# EAGLE design DSP (EAGLE 9.4.2)
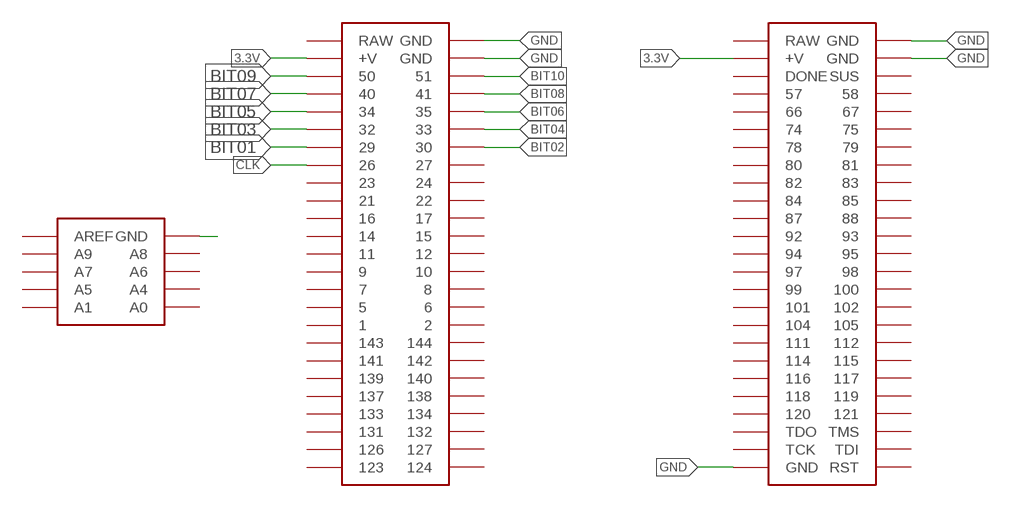
[diagram p0: schematic, sheet 1, part 1 of 2]
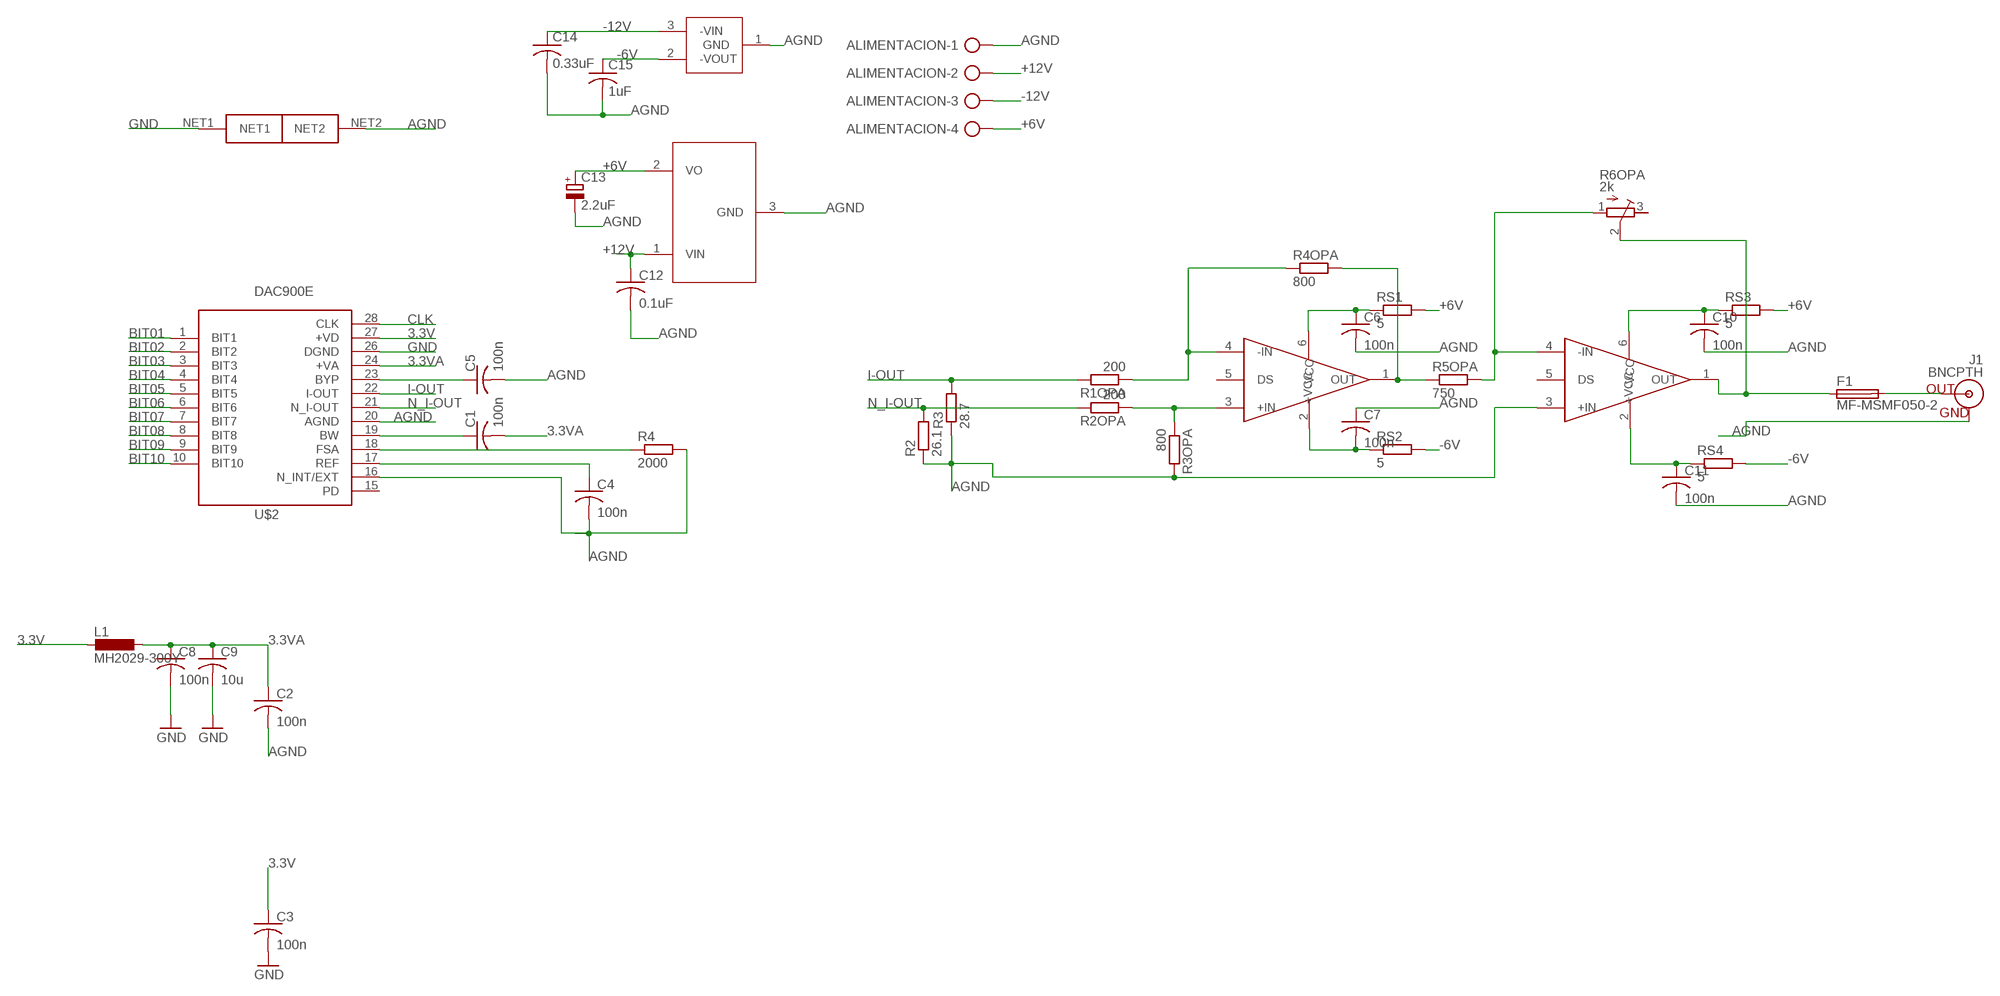
[diagram p1: schematic, sheet 1, part 2 of 2]

## Parts
ALIMENTACION  AK300/4  [AK300/4]
C1  100n  C-USC0603  [C0603]
C2  100n  C-USC0603  [C0603]
C3  100n  C-USC0603  [C0603]
C4  100n  C-USC0603  [C0603]
C5  100n  C-USC0603  [C0603]
C6  100n  C-USC0603  [C0603]
C7  100n  C-USC0603  [C0603]
C8  100n  C-USC0603  [C0603]
C9  10u  C-USC0603  [C0603]
C10  100n  C-USC0603  [C0603]
C11  100n  C-USC0603  [C0603]
C12  0.1uF  C-USC0603  [C0603]
C13  2.2uF  CPOL-EUE2.5-6  [E2,5-6]
C14  0.33uF  C-USC0603  [C0603]
C15  1uF  C-USC0603  [C0603]
F1  MF-MSMF050-2  [1812]
J1  BNCPTH  [BNC]
L1  MH2029-300Y  L_0805  [R0805]
R1OPA  200  R-EU_R0603  [R0603]
R2  26.1  R-EU_R0603  [R0603]
R2OPA  200  R-EU_R0603  [R0603]
R3  28.7  R-EU_R0603  [R0603]
R3OPA  800  R-EU_R0603  [R0603]
R4  2000  R-EU_R0603  [R0603]
R4OPA  800  R-EU_R0603  [R0603]
R5OPA  750  R-EU_R0603  [R0603]
R6OPA  2k  R-TRIMM3296W  [RTRIM3296W]
RS1  5  R-EU_0309/10  [0309/10]
RS2  5  R-EU_0309/10  [0309/10]
RS3  5  R-EU_0309/10  [0309/10]
RS4  5  R-EU_0309/10  [0309/10]
U$1  MOJO_V2V3_NO_LABEL  [MOJO_V3_NO_LABEL]
U$2  DAC900E  [TSSOP28]
U$3  OPA683  [SOT23-6]
U$4  NET_TIE  [NET-TIE]
U$5  OPA683  [SOT23-6]
U$6  LF60  [TO252]
U$7  MC7906  [TO263]

## Nets
3.3V: C3.1 L1.2 U$1.V@1(+V) U$1.V@2(+V) U$2.27(+VD)
3.3VA: C1.2 C2.1 C8.1 C9.1 L1.1 U$2.24(+VA)
+6V: ALIMENTACION.4 C13.+ RS1.2 RS3.2 U$6.2(VO)
+12V: ALIMENTACION.2 C12.1 U$6.1(VIN)
-6V: C15.1 RS2.2 RS4.2 U$7.2(-VOUT)
-12V: ALIMENTACION.3 C14.1 U$7.3(-VIN)
AGND: ALIMENTACION.1 C2.2 C4.2 C5.2 C6.2 C7.1 C10.2 C11.2 C12.2 C13.- C14.2 C15.2 J1.GND R2.1 R3.1 R3OPA.2 R4.2 U$2.16(N_INT/EXT) U$2.20(AGND) U$4.NET2 U$5.3(+IN) U$6.3(GND) U$7.1(GND)
BIT01: U$1.29 U$2.1(BIT1)
BIT02: U$1.30 U$2.2(BIT2)
BIT03: U$1.32 U$2.3(BIT3)
BIT04: U$1.33 U$2.4(BIT4)
BIT05: U$1.34 U$2.5(BIT5)
BIT06: U$1.35 U$2.6(BIT6)
BIT07: U$1.40 U$2.7(BIT7)
BIT08: U$1.41 U$2.8(BIT8)
BIT09: U$1.50 U$2.9(BIT9)
BIT10: U$1.51 U$2.10(BIT10)
CLK: U$1.26 U$2.28(CLK)
GND: C3.2 C8.2 C9.2 U$1.GND@1(GND) U$1.GND@2(GND) U$1.GND@3(GND) U$1.GND@4(GND) U$1.GND@5(GND) U$1.GND@6(GND) U$2.26(DGND) U$4.NET1
I-OUT: R1OPA.2 R3.2 U$2.22(I-OUT)
N$1: R5OPA.2 R6OPA.1(A) U$5.4(-IN)
N$2: F1.1 R6OPA.2(S) U$5.1(OUT)
N$3: R2OPA.1 R3OPA.1 U$3.3(+IN)
N$4: R1OPA.1 R4OPA.1 U$3.4(-IN)
N$5: R4OPA.2 R5OPA.1 U$3.1(OUT)
N$6: C10.1 RS3.1 U$5.6(+VCC)
N$7: C11.1 RS4.1 U$5.2(-VCC)
N$8: C6.1 RS1.1 U$3.6(+VCC)
N$9: C7.2 RS2.1 U$3.2(-VCC)
N$10: F1.2 J1.S(OUT)
N$16: C5.1 U$2.23(BYP)
N$19: C1.1 U$2.19(BW)
N$20: R4.1 U$2.18(FSA)
N$21: C4.1 U$2.17(REF)
N_I-OUT: R2.2 R2OPA.2 U$2.21(N_I-OUT)
Unconnected: R6OPA.3(E) U$1.1 U$1.2 U$1.5 U$1.6 U$1.7 U$1.8 U$1.9 U$1.10 U$1.11 U$1.12 U$1.14 U$1.15 U$1.16 U$1.17 U$1.21 U$1.22 U$1.23 U$1.24 U$1.27 U$1.57 U$1.58 U$1.66 U$1.67 U$1.74 U$1.75 U$1.78 U$1.79 U$1.80 U$1.81 U$1.82 U$1.83 U$1.84 U$1.85 U$1.87 U$1.88 U$1.92 U$1.93 U$1.94 U$1.95 U$1.97 U$1.98 U$1.99 U$1.100 U$1.101 U$1.102 U$1.104 U$1.105 U$1.111 U$1.112 U$1.114 U$1.115 U$1.116 U$1.117 U$1.118 U$1.119 U$1.120 U$1.121 U$1.123 U$1.124 U$1.126 U$1.127 U$1.131 U$1.132 U$1.133 U$1.134 U$1.137 U$1.138 U$1.139 U$1.140 U$1.141 U$1.142 U$1.143 U$1.144 U$1.A0 U$1.A1 U$1.A4 U$1.A5 U$1.A6 U$1.A7 U$1.A8 U$1.A9 U$1.AREF U$1.DONE U$1.RAW@1(RAW) U$1.RAW@2(RAW) U$1.RST U$1.SUS U$1.TCK U$1.TDI U$1.TDO U$1.TMS U$2.15(PD) U$3.5(DS) U$5.5(DS)

## Library data of the parts
ALIMENTACION = con-ptr500:AK300/4: CONNECTOR; OC_FARNELL: unknown; OC_NEWARK: unknown
C1-C12 C14 C15 = rcl:C-US: CAPACITOR, American symbol; SPICEPREFIX: C
C13 = rcl:CPOL-EU: POLARIZED CAPACITOR, European symbol; SPICEPREFIX: C
F1 = Thermistor_Inductors:MF-MSMF050-2: PTC RESET FUSE 15V 500MA 1812 Manufacturer's datasheet <https://www.bourns.com/docs/Product-Datasheets/mfmsmf.pdf>; CREATED_BY: PCBLayout.com; DIGIKEY_PART_NUMBER: MF-MSMF050-2TR-ND; MANUFACTURER: Bourns Inc.; MPN: MF-MSMF050-2; PACKAGE: 1812
J1 = SparkFun-Connectors:BNC: BNC Right Angle Connector Mouser Part# 5227161 SparkFun Products: BNC Connector - Right Angle <https://www.sparkfun.com/products/10550>; PROD_ID: LPA-12729; SF_ID: PRT-10550
L1 = 0myLib:L_0805
R1OPA R2 R2OPA R3 R3OPA R4 R4OPA R5OPA RS1-RS4 = rcl:R-EU_: RESISTOR, European symbol; SPICEPREFIX: R
R6OPA = rcl:R-TRIMM: Trimm resistor; SPICEMODEL: X; SPICEPREFIXL: POT
U$1 = IO_Shield:MOJO_V2
U$2 = 0myLib:DAC900E
U$3 U$5 = OPA683:OPA683
U$4 = 0myLib:NET_TIE
U$6 = fuente +6v:LF60
U$7 = fuente -6v:MC7906

## Board
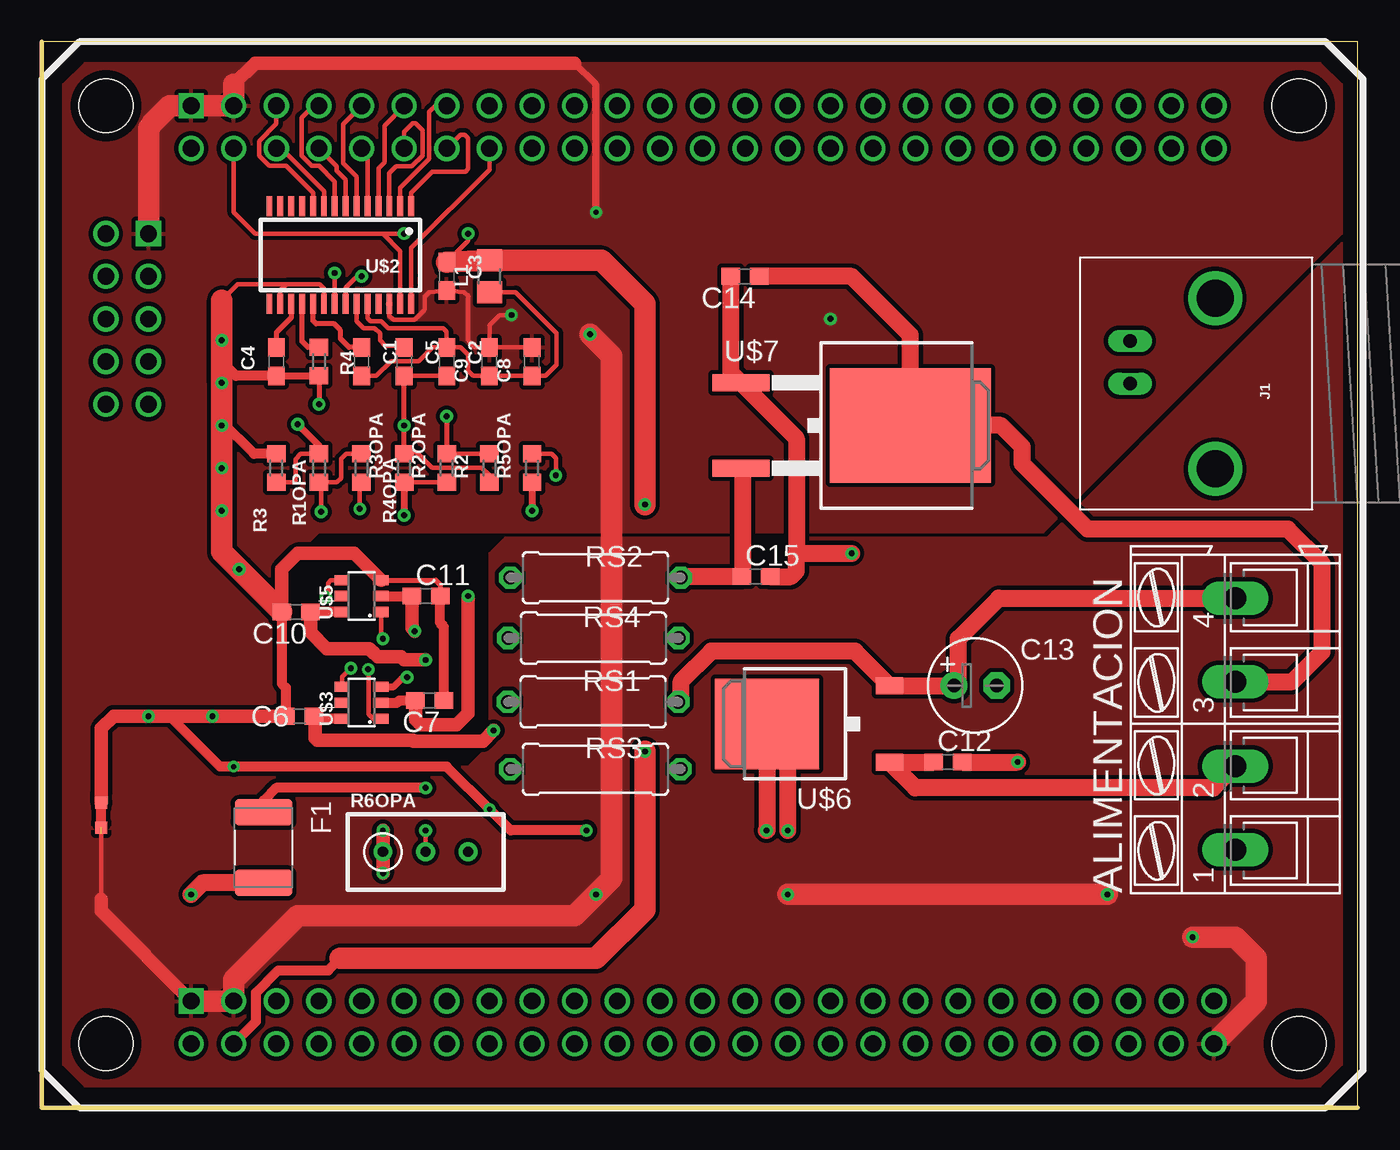
[diagram p2: board, top side]
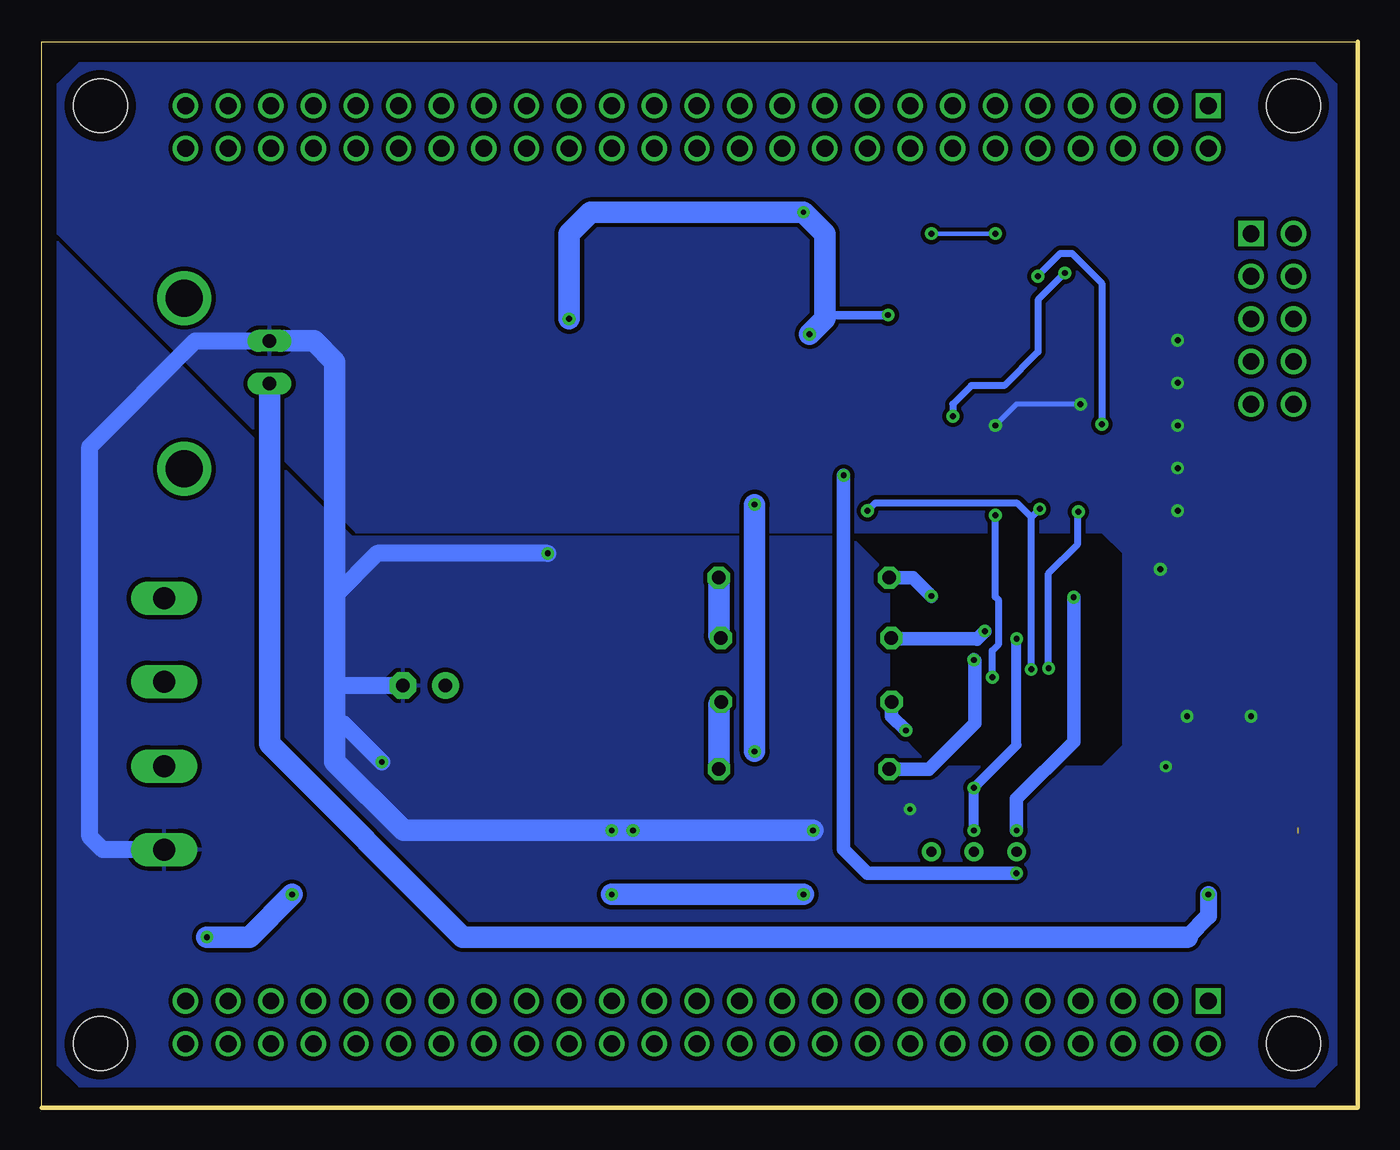
[diagram p3: board, bottom side, seen from below]

Size 78.41 x 63.49 mm. Coordinates in mm from the lower left corner, seen from the top.
Outline: 0,0 78.41,0 78.41,63.49 0,63.49 0,0
Copper layers (1*16): Top 0.035mm / dielectric 1.5mm / Bottom 0.035mm
Design rules "PCBWAY": minimum track width 6mil, minimum drill 0.3mm, track to track 6mil, track to pad 6mil, pad to pad 6mil, via to via 6mil, smd to smd 6mil, copper to edge 20mil, drill to drill 8mil, minimum pad ring 10mil, minimum via ring 8mil, stop-mask expansion 3.5mil, vias tented up to drill 0.6mm, thermal gap 10mil

### Footprints (pad centres in the part's own frame; a part is rotated, then mirrored left to right if it is on the bottom)
AK300/4 = drill 1.321 long: 1 -7.493,0; 2 -2.515,0; 3 2.515,0; 4 7.493,0
C0603 = smd 1.1 x 1: 1 -0.85,0; 2 0.85,0
E2,5-6 = drill 0.813 pad 1.6: + -1.27,0 | drill 0.813 pad 1.6 octagon: - 1.27,0
1812 = smd 1.58 x 3.43: 1 -2.1,0; 2 2.1,0
BNC = drill 2.2: 3 -5.08,5.08; 4 5.08,5.08 | drill 0.8 long: GND -2.54,0; S 0,0
R0805 = smd 1.3 x 1.5: 1 -0.95,0; 2 0.95,0
R0603 = smd 1 x 1.1: 1 -0.85,0; 2 0.85,0
RTRIM3296W = drill 0.61: 1 0,-2.54; 2 0,0; 3 0,2.54
0309/10 = drill 0.813 octagon: 1 -5.08,0; 2 5.08,0
MOJO_V3_NO_LABEL = drill 1: 1 49.53,57.15; 2 49.53,59.69; 5 46.99,57.15; 6 46.99,59.69; 7 44.45,57.15; 8 44.45,59.69; 9 41.91,57.15; 10 41.91,59.69; 11 39.37,57.15; 12 39.37,59.69; 14 36.83,57.15; 15 36.83,59.69; 16 34.29,57.15; 17 34.29,59.69; 21 31.75,57.15; 22 31.75,59.69; 23 29.21,57.15; 24 29.21,59.69; 26 26.67,57.15; 27 26.67,59.69; 29 24.13,57.15; 30 24.13,59.69; 32 21.59,57.15; 33 21.59,59.69; 34 19.05,57.15; 35 19.05,59.69; 40 16.51,57.15; 41 16.51,59.69; 50 13.97,57.15; 51 13.97,59.69; 57 16.51,3.81; 58 16.51,6.35; 66 19.05,3.81; 67 19.05,6.35; 74 21.59,3.81; 75 21.59,6.35; 78 24.13,3.81; 79 24.13,6.35; 80 26.67,3.81; 81 26.67,6.35; 82 29.21,3.81; 83 29.21,6.35; 84 31.75,3.81; 85 31.75,6.35; 87 34.29,3.81; 88 34.29,6.35; 92 36.83,3.81; 93 36.83,6.35; 94 39.37,3.81; 95 39.37,6.35; 97 41.91,3.81; 98 41.91,6.35; 99 44.45,3.81; 100 44.45,6.35; 101 46.99,3.81; 102 46.99,6.35; 104 49.53,3.81; 105 49.53,6.35; 111 52.07,3.81; 112 52.07,6.35; 114 54.61,3.81; 115 54.61,6.35; 116 57.15,3.81; 117 57.15,6.35; 118 59.69,3.81; 119 59.69,6.35; 120 62.23,3.81; 121 62.23,6.35; 123 69.85,57.15; 124 69.85,59.69; 126 67.31,57.15; 127 67.31,59.69; 131 64.77,57.15; 132 64.77,59.69; 133 62.23,57.15; 134 62.23,59.69; 137 59.69,57.15; 138 59.69,59.69; 139 57.15,57.15; 140 57.15,59.69; 141 54.61,57.15; 142 54.61,59.69; 143 52.07,57.15; 144 52.07,59.69; A0 6.35,41.91; A1 3.81,41.91; A4 6.35,44.45; A5 3.81,44.45; A6 6.35,46.99; A7 3.81,46.99; A8 6.35,49.53; A9 3.81,49.53; AREF 3.81,52.07; DONE 13.97,3.81; GND@2 11.43,59.69; GND@4 11.43,6.35; GND@6 69.85,3.81; RAW@1 8.89,57.15; RAW@2 8.89,3.81; RST 69.85,6.35; SUS 13.97,6.35; TCK 67.31,3.81; TDI 67.31,6.35; TDO 64.77,3.81; TMS 64.77,6.35; V@1 11.43,57.15; V@2 11.43,3.81 | drill 1 square: GND@1 8.89,59.69; GND@3 8.89,6.35; GND@5 6.35,52.07 | hole 3.2: 3.81,3.81; 3.81,59.69; 74.93,59.69; 74.93,3.81
TSSOP28 = smd 0.35 x 1.2: 1 -4.225,-2.9; 2 -3.575,-2.9; 3 -2.925,-2.9; 4 -2.275,-2.9; 5 -1.625,-2.9; 6 -0.975,-2.9; 7 -0.325,-2.9; 8 0.325,-2.9; 9 0.975,-2.9; 10 1.625,-2.9; 11 2.275,-2.9; 12 2.925,-2.9; 13 3.575,-2.9; 14 4.225,-2.9; 15 4.225,2.9; 16 3.575,2.9; 17 2.925,2.9; 18 2.275,2.9; 19 1.625,2.9; 20 0.975,2.9; 21 0.325,2.9; 22 -0.325,2.9; 23 -0.975,2.9; 24 -1.625,2.9; 25 -2.275,2.9; 26 -2.925,2.9; 27 -3.575,2.9; 28 -4.225,2.9
SOT23-6 = smd 0.6 x 0.9: 1 -0.95,-1.15; 2 0,-1.15; 3 0.95,-1.15; 4 0.95,1.15; 5 0,1.15; 6 -0.95,1.15
NET-TIE = smd 0.711 x 0.711: NET1 -0.77,0; NET2 0.73,0
TO252 = smd 1 x 1.6: 1 -2.28,-4.8; 2 2.28,-4.8 | smd 5.4 x 6.2: 3 0,2.5
TO263 = smd 1 x 3.4: 1 -2.54,-6.6; 2 2.54,-6.6 | smd 6.8 x 9.6: 3 0,3.5

### Placement (x,y rotation side)
ALIMENTACION  71.12,22.86 90 top
C1  19.05,44.45 270 top
C2  24.13,44.45 270 top
C3  24.13,49.53 270 top
C4  13.97,44.45 270 top
C5  21.59,44.45 270 top
C6  15.35,23.32 180 top
C7  23.11,24.26 180 top
C8  29.21,44.45 90 top
C9  26.67,44.45 90 top
C10  15.15,29.53 180 top
C11  22.9,30.48 0 top
C12  54,20.59 0 top
C13  55.63,25.15 0 top
C14  41.91,49.53 180 top
C15  42.55,31.64 0 top
F1  13.21,15.49 270 top
J1  64.84,43.14 270 top
L1  26.67,49.53 90 top
R1OPA  16.51,38.1 90 top
R2  26.67,38.1 90 top
R2OPA  24.13,38.1 90 top
R3  13.97,38.1 270 top
R3OPA  21.59,38.1 90 top
R4  16.51,44.45 270 top
R4OPA  19.05,38.1 270 top
R5OPA  29.21,38.1 90 top
R6OPA  22.86,15.24 270 top
RS1  32.85,24.17 0 top
RS2  32.99,31.57 0 top
RS3  32.99,20.17 0 top
RS4  32.87,27.97 0 top
U$1  0,0 0 top
U$2  17.78,50.8 180 top
U$3  19.05,24.13 90 top
U$4  3.55,17.44 90 top
U$5  19.05,30.48 90 top
U$6  45.72,22.86 90 top
U$7  48.26,40.64 270 top

### Tracks (layer width: path | path; a pad name or v marks a point on that pad's centre or on a via)
3.3V  (via drill 0.35)
  Top 0.254: v25.4,52.07 25.4,51.65 C3.1 | v21.59,52.07 20.32,52.07 | 20.32,52.07 12.7,52.07 11.43,53.34 U$1.V@1 | U$2.27 21.36,51.03 20.32,52.07
  Top 0.61: U$1.V@2 12.76,5.14 12.76,6.85 14.09,8.18 17.07,8.18 17.78,8.89
  Top 1.27: C3.1 L1.2 33.34,50.48 35.93,47.89 v35.93,35.93 | 17.78,8.89 33.02,8.89 35.93,11.8 v35.93,21.22
  Bottom 0.254: v25.4,52.07 v21.59,52.07
  Bottom 1.27: v35.93,21.22 v35.93,35.93
3.3VA
  Top 0.254: C1.2 19.93,43.6 20.8,44.47 22.46,44.47 23.29,45.3 C2.1 | L1.1 28.24,48.58 30.68,46.14 30.68,44.27 30.01,43.6 C8.1 C9.1 25.7,43.6 25.39,43.91 25.39,44.85 24.94,45.3 C2.1 | C2.1 24.13,46.22 23.9,46.45 20.63,46.45 20.23,46.85 19.6,46.85 19.41,47.04 U$2.24
+6V
  Top 1.016: RS1.2 38.1,24.34 38.1,25.4 39.9,27.2 48.46,27.2 U$6.2 C13.+ 54.61,25.4 54.61,27.94 57.02,30.35 ALIMENTACION.4
  Bottom 1.27: RS3.2 38.07,24.04 RS1.2
+12V
  Top 1.016: C12.1 53.14,20.58 U$6.1 52.05,19.05 69.83,19.05 ALIMENTACION.2
-6V
  Top 1.016: U$7.2 41.74,38.02 41.74,31.68 C15.1 38.13,31.63 RS2.2
  Bottom 1.27: RS2.2 38.07,28.1 RS4.2
-12V
  Top 1.016: ALIMENTACION.3 74.52,25.38 76.3,27.16 76.3,32.42 74.27,34.46 62.32,34.46 58.42,38.36 58.42,39.37 57.15,40.64 U$7.3 51.76,46.03 48.26,49.53 C14.1
AGND  (via drill 0.3, 0.35)
  Top 0.254: C4.2 13.95,43.47 | C2.2 C5.2 | 14.57,49.05 16.54,49.05 16.8,48.79 U$2.20 | U$2.20 | U$2.16 14.21,48.68 14.57,49.05 | R2.1 26.67,37.66 26.21,38.12 23.26,38.12 22.34,39.05 R3OPA.2 | C4.2 13.9,43.53 | 14.07,43.5 C4.2 | 14.57,49.05 11.67,49.05 10.72,48.1
  Top 0.305: 27.07,37.15 R2.1 | U$5.3 23.46,31.43 23.74,31.16 23.74,30.47 | R3OPA.2 v21.59,40.64 C5.2 | R4.2 v16.51,41.91
  Top 0.406: C4.2 R4.2
  Top 0.61: C4.2 11.57,43.6 10.72,44.45 | R3.1 12.64,38.95 10.72,40.88 | C10.2 14.3,25.26 14.53,25.03 14.53,23.35 C6.2 | C7.1 23.96,28.65 23.74,28.87 23.74,30.47 C11.2 | 7.62,23.32 10.62,20.32 v11.43,20.32 24.13,20.32 v26.67,17.78 27.94,16.51 v32.45,16.51
  Top 0.813: U$5.3 18.61,33.02 15.24,33.02 14.3,32.08 C10.2 | C6.2 v10.16,23.32 7.62,23.32 v6.35,23.32 4.27,23.32 3.55,22.6 3.55,18.81 3.55,18.8 U$4.NET2
  Top 1.016: C12.2 v58.15,20.59 | U$6.3 43.22,16.55 v43.18,16.51 | v44.45,16.51 44.45,21.59 | C14.2 41.06,43.78 U$7.1 44.97,39.87 44.97,33.02 | C15.2 44.64,31.64 44.97,31.97 44.97,33.02 | 44.97,33.02 v48.26,33.02
  Top 1.27: 10.72,40.88 v10.72,40.64 | v10.72,40.64 v10.72,38.1 v10.72,35.56 10.72,33.11 v11.76,32.08 C10.2 | v10.72,40.64 v10.72,43.18 10.72,44.45 v10.72,45.72 10.72,48.1
  Bottom 0.305: v16.51,41.91 20.32,41.91 v21.59,40.64
  Bottom 1.016: C13.- 60.71,25.15 60.96,25.4 | v58.15,20.59 60.42,22.86 60.96,22.86 | ALIMENTACION.1 74.78,15.37 75.56,16.15 75.56,39.39 69.27,45.68 J1.GND | v48.26,33.02 58.42,33.02 60.96,30.48
  Bottom 1.27: v32.45,16.51 v43.18,16.51 v44.45,16.51 56.85,16.51 60.96,20.62 60.96,22.86 60.96,25.4 60.96,30.48 60.96,44.45 62.19,45.68 J1.GND
  pour Bottom (isolate 0.254): 1.27,60.96 2.54,62.23 76.2,62.23 77.47,60.96 77.47,52.07 59.69,34.29 15.24,34.29 13.97,33.02 13.97,21.59 15.24,20.32 16.51,20.32 25.4,20.32 27.94,22.86 27.94,31.75 30.21,34.02 31.81,34.02 59.91,34.02 77.47,51.57 77.47,2.54 76.2,1.27 2.54,1.27 1.27,2.54
BIT01
  Top 0.254: U$2.1 22,54.51 23.27,55.77 25.26,55.77 25.41,55.92 25.41,57.75 25.2,57.97 24.95,57.97 U$1.29
BIT02
  Top 0.254: U$2.2 21.36,54.81 23.09,56.54 23.09,59.32 23.46,59.69 U$1.30
BIT03
  Top 0.254: U$2.3 20.71,55.66 21.12,56.08 22.04,56.08 22.68,56.71 22.68,58.22 22.25,58.64 22.1,58.64 21.59,58.13 U$1.32
BIT04
  Top 0.254: U$2.4 20.05,55.98 20.41,56.34 20.41,58.51 U$1.33
BIT05
  Top 0.254: U$1.34 19.41,56.79 U$2.5
BIT06
  Top 0.254: U$1.35 17.95,58.59 17.95,56.27 18.75,55.46 U$2.6
BIT07
  Top 0.254: U$2.7 18.11,55.28 17.57,55.81 17.57,56.09 U$1.40
BIT08
  Top 0.254: U$2.8 17.46,55.17 16.51,56.12 16.08,56.12 15.48,56.72 15.48,58.98 16.19,59.7 U$1.41
BIT09
  Top 0.254: U$2.9 16.8,54.6 14.26,57.15 U$1.50
BIT10
  Top 0.254: U$1.51 13.97,58.61 12.94,57.58 12.94,56.72 13.54,56.12 14.55,56.12 16.16,54.51 U$2.10
CLK
  Top 0.254: U$2.28 22,49.01 22.01,49.02 22.01,49.57 22,49.57 22,51.21 26.67,55.88 U$1.26
GND  (via drill 0.3, 0.35)  (1 unrouted)
  Top 0.254: C8.2 C9.2 | C9.2 26.67,46.61 27.28,47.22 v27.98,47.22 | U$2.26 20.71,47.18 20.96,46.93 22.2,46.93 22.8,47.52 22.8,48.31 23.07,48.58 C3.2 25.17,48.58 25.42,48.33 25.4,48.32 25.4,45.72 25.82,45.3 C9.2 | 3.55,16.36 3.52,16.34 3.52,11.71
  Top 0.406: v33.02,53.34 33.02,60.96 31.75,62.23
  Top 0.813: U$1.GND@3 3.52,11.71 3.52,12.42 | 31.75,62.23 12.7,62.23 11.43,60.96
  Top 1.27: U$1.GND@5 6.35,58.35 6.55,58.55 6.55,58.62 7.62,59.69 U$1.GND@1 U$1.GND@2 11.43,60.96 | U$1.GND@6 72.39,6.35 72.39,8.89 71.12,10.16 v68.58,10.16 | U$1.GND@3 U$1.GND@4 11.43,7.62 15.24,11.43 31.75,11.43 v33.02,12.7 33.94,13.62 33.94,44.8 v32.66,46.08 | v63.5,12.7 v44.45,12.7
  Bottom 0.508: v27.98,47.22 31.52,47.22 31.75,46.99
  Bottom 1.27: v32.66,46.08 31.75,46.99 31.75,52.07 v33.02,53.34 45.72,53.34 46.99,52.07 v46.99,46.99 | v68.58,10.16 66.04,10.16 v63.5,12.7 | v44.45,12.7 v33.02,12.7
  pour Top (isolate 0.254): 1.27,60.96 2.54,62.23 76.2,62.23 77.47,60.96 77.47,52.07 59.69,34.29 16.51,34.29 15.24,33.02 15.24,21.59 16.51,20.32 24.13,20.32 25.4,20.32 26.67,21.59 26.67,33.02 27.62,33.97 28.1,33.97 59.9,33.97 60.22,34.29 77.26,51.33 77.26,51.33 77.47,51.54 77.47,2.54 76.2,1.27 2.54,1.27 1.27,2.54
I-OUT  (via drill 0.35)
  Top 0.254: U$2.22 18.11,48.84 18.67,49.4 18.92,49.4 v19.05,49.53 | R3.2 15.02,37.25 15.11,37.34 15.11,38.64 15.42,38.95 R1OPA.2
  Top 0.406: v15.24,40.72 16.51,39.45 R1OPA.2
  Bottom 0.406: v19.05,49.53 19.05,49.56 17.72,50.89 17.03,50.89 15.24,49.1 v15.24,40.72
N$1  (via drill 0.35)
  Top 0.254: U$5.4 17.22,31.43 17.04,31.25 17.04,30.54 v16.92,30.41 | v20.32,13.97 v20.33,13.97 | v30.63,37.67 30.63,38.7 30.37,38.95 R5OPA.2
  Top 0.813: v20.32,13.97 R6OPA.1 v20.32,16.51
  Bottom 0.813: v20.33,13.97 29.21,13.97 30.63,15.39 v30.63,37.67 | v20.32,16.51 20.32,18.4 16.92,21.8 v16.92,30.41
N$2  (via drill 0.35)
  Top 0.254: U$5.1 20.2,27.97 20.23,27.94 v20.32,27.94 | v22.86,16.51 R6OPA.2
  Top 0.61: v22.86,19.05 13.97,19.05 13.21,18.29 F1.1
  Bottom 0.61: v22.86,16.51 v22.86,19.05 20.32,21.59 v20.32,27.94
N$3  (via drill 0.35)
  Top 0.254: R2OPA.1 R3OPA.1 21.56,37.12 21.59,37.09
  Top 0.406: U$3.3 20.96,25.08 21.54,25.65 v21.77,25.65 v21.77,25.64 | R3OPA.1 v21.59,35.29
  Bottom 0.406: v21.77,25.64 21.77,27.23 21.38,27.61 21.38,30.22 21.59,30.43 v21.59,35.29 21.59,35.4
N$4  (via drill 0.35)
  Top 0.254: R4OPA.1 18.12,38.95 17.82,38.66 17.82,37.5 17.57,37.25 R1OPA.1 16.64,37.12 v16.64,35.5 | U$3.4 17.9,25.66 v18.41,26.18
  Bottom 0.254: 16.67,35.53 16.64,35.5 v16.64,35.5
  Bottom 0.406: v18.41,26.18 18.41,31.83 16.67,33.57 16.67,35.53
N$5  (via drill 0.35)
  Top 0.254: U$3.1 19.72,23.18 19.47,23.43 19.47,26.08 v19.45,26.11 | v18.94,35.67 18.94,37.14 R4OPA.2
  Top 0.406: R5OPA.1 v29.21,35.56
  Bottom 0.406: v19.45,26.11 19.45,35.16 | 19.45,35.16 v18.94,35.67 | v29.21,35.56 28.74,36.03 20.31,36.03 19.45,35.16
N$6  (via drill 0.35)
  Top 0.61: U$5.6 C10.1
  Top 0.813: v22.86,26.67 21.59,26.67 21.4,26.86 20.02,26.86 19.84,27.04 19.82,27.04 19.51,27.35 16.96,27.35 16,28.31 C10.1
  Bottom 0.813: v22.86,26.67 22.82,26.63 22.82,22.9 25.55,20.17 RS3.1
N$7  (via drill 0.35)
  Top 0.61: U$5.2 C11.1
  Top 0.813: C11.1 22.05,28.56 v22.22,28.39
  Bottom 0.813: v22.22,28.39 22.69,27.92 22.71,27.94 27.75,27.94 RS4.1
N$8  (via drill 0.35)
  Top 0.61: U$3.6 16.35,23.18 C6.1
  Top 0.813: v26.92,22.47 26.29,21.84 22.16,21.84 22.12,21.88 16.4,21.88 16.28,22 16.28,23.11 16.35,23.18
  Bottom 0.813: v26.92,22.47 27.77,23.32 RS1.1
N$9  (via drill 0.35)
  Top 0.254: 20.31,24.24 U$3.2
  Top 0.61: U$3.2 21.19,24.13 21.32,24.26 C7.2
  Top 0.813: C7.2 22.26,23.11 22.56,22.8 24.7,22.8 25.4,23.5 v25.4,30.48
  Bottom 0.813: v25.4,30.48 26.49,31.57 RS2.1
N$10  (via drill 0.35)
  Top 1.016: F1.2 9.58,13.39 v8.89,12.7
  Bottom 1.016: v8.89,12.7 8.89,11.43 10.16,10.16
  Bottom 1.27: 10.16,10.16 53.34,10.16 64.84,21.66 J1.S
N$16
  Top 0.254: U$2.23 18.75,46.86 19.18,46.44 19.84,46.44 20.14,46.14 20.14,45.72 20.46,45.4 21.49,45.4 C5.1
N$19
  Top 0.305: C1.1 18.3,45.3 17.79,45.81 17.79,46.31 17.41,46.69 16.34,46.69 16.16,46.88 U$2.19
N$20
  Top 0.305: R4.1 15.85,45.3 15.5,45.65 U$2.18
N$21
  Top 0.305: U$2.17 14.86,47.06 13.97,46.18 C4.1
N_I-OUT  (via drill 0.35)
  Top 0.254: U$2.21 17.46,49.53 arc-90 17.45,49.54 v17.45,49.73 | R2OPA.2 R2.2
  Top 0.305: v24.12,41.19 v24.13,41.18 R2OPA.2
  Bottom 0.406: v17.45,49.73 19.05,48.12 19.05,45.02 21.06,43.01 22.86,43.01 23.03,43.01 24.13,41.91 v24.13,41.2 v24.12,41.19